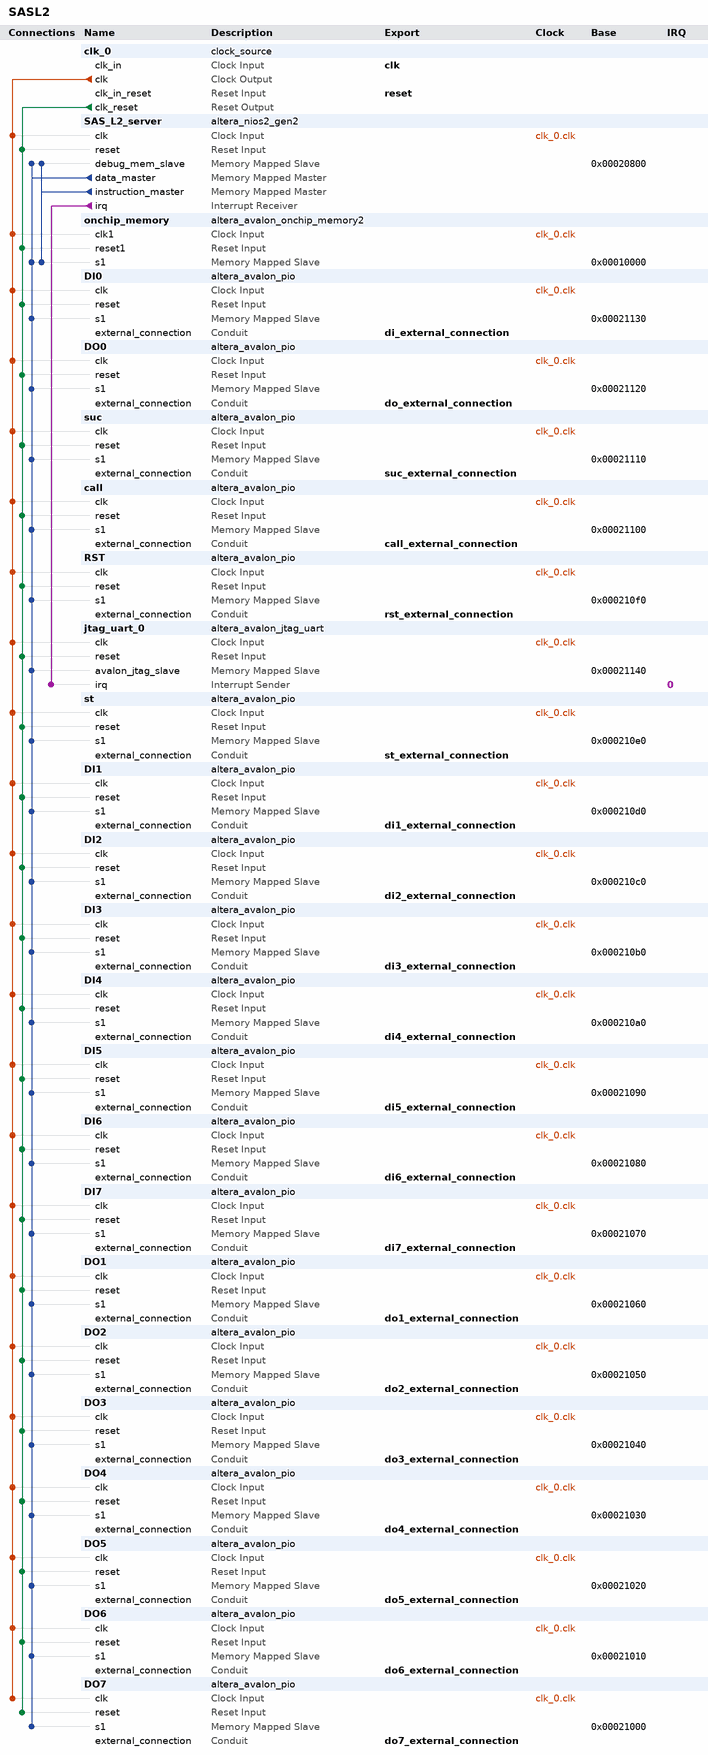
[diagram p0: system contents]
# Platform Designer (Qsys) system SASL2, MAX 10 10M50DAF484C7G
# Parameters at their usual value, and those the tool derives, are not listed.
package require -exact qsys 18.1
create_system SASL2
set_project_property DEVICE_FAMILY {MAX 10}
set_project_property DEVICE 10M50DAF484C7G

add_instance clk_0 clock_source 18.1
set_instance_parameter_value clk_0 clockFrequency 50000000

add_instance SAS_L2_server altera_nios2_gen2 18.1
set_instance_parameter_value SAS_L2_server dcache_size 2048
set_instance_parameter_value SAS_L2_server exceptionSlave onchip_memory.s1
set_instance_parameter_value SAS_L2_server icache_size 4096
set_instance_parameter_value SAS_L2_server impl Tiny
set_instance_parameter_value SAS_L2_server resetSlave onchip_memory.s1

add_instance onchip_memory altera_avalon_onchip_memory2 18.1
set_instance_parameter_value onchip_memory dataWidth 32
set_instance_parameter_value onchip_memory dualPort false
set_instance_parameter_value onchip_memory initMemContent false
set_instance_parameter_value onchip_memory initializationFileName onchip_mem.hex
set_instance_parameter_value onchip_memory memorySize 65536

add_instance DI0 altera_avalon_pio 18.1
set_instance_parameter_value DI0 direction Output
set_instance_parameter_value DI0 width 32

add_instance DO0 altera_avalon_pio 18.1
set_instance_parameter_value DO0 captureEdge true
set_instance_parameter_value DO0 direction Input
set_instance_parameter_value DO0 simDoTestBenchWiring true
set_instance_parameter_value DO0 simDrivenValue 1
set_instance_parameter_value DO0 width 32

add_instance suc altera_avalon_pio 18.1
set_instance_parameter_value suc direction Output
set_instance_parameter_value suc width 1

add_instance call altera_avalon_pio 18.1
set_instance_parameter_value call direction Output
set_instance_parameter_value call width 1

add_instance RST altera_avalon_pio 18.1
set_instance_parameter_value RST direction Output
set_instance_parameter_value RST width 1

add_instance jtag_uart_0 altera_avalon_jtag_uart 18.1
set_instance_parameter_value jtag_uart_0 simInteractiveOptions NO_INTERACTIVE_WINDOWS

add_instance st altera_avalon_pio 18.1
set_instance_parameter_value st captureEdge true
set_instance_parameter_value st direction Input
set_instance_parameter_value st width 3

add_instance DI1 altera_avalon_pio 18.1
set_instance_parameter_value DI1 direction Output
set_instance_parameter_value DI1 width 32

add_instance DI2 altera_avalon_pio 18.1
set_instance_parameter_value DI2 direction Output
set_instance_parameter_value DI2 width 32

add_instance DI3 altera_avalon_pio 18.1
set_instance_parameter_value DI3 direction Output
set_instance_parameter_value DI3 width 32

add_instance DI4 altera_avalon_pio 18.1
set_instance_parameter_value DI4 direction Output
set_instance_parameter_value DI4 width 32

add_instance DI5 altera_avalon_pio 18.1
set_instance_parameter_value DI5 direction Output
set_instance_parameter_value DI5 width 32

add_instance DI6 altera_avalon_pio 18.1
set_instance_parameter_value DI6 direction Output
set_instance_parameter_value DI6 width 32

add_instance DI7 altera_avalon_pio 18.1
set_instance_parameter_value DI7 direction Output
set_instance_parameter_value DI7 width 32

add_instance DO1 altera_avalon_pio 18.1
set_instance_parameter_value DO1 captureEdge true
set_instance_parameter_value DO1 direction Input
set_instance_parameter_value DO1 simDoTestBenchWiring true
set_instance_parameter_value DO1 simDrivenValue 1
set_instance_parameter_value DO1 width 32

add_instance DO2 altera_avalon_pio 18.1
set_instance_parameter_value DO2 captureEdge true
set_instance_parameter_value DO2 direction Input
set_instance_parameter_value DO2 simDoTestBenchWiring true
set_instance_parameter_value DO2 simDrivenValue 1
set_instance_parameter_value DO2 width 32

add_instance DO3 altera_avalon_pio 18.1
set_instance_parameter_value DO3 captureEdge true
set_instance_parameter_value DO3 direction Input
set_instance_parameter_value DO3 simDoTestBenchWiring true
set_instance_parameter_value DO3 simDrivenValue 1
set_instance_parameter_value DO3 width 32

add_instance DO4 altera_avalon_pio 18.1
set_instance_parameter_value DO4 captureEdge true
set_instance_parameter_value DO4 direction Input
set_instance_parameter_value DO4 simDoTestBenchWiring true
set_instance_parameter_value DO4 simDrivenValue 1
set_instance_parameter_value DO4 width 32

add_instance DO5 altera_avalon_pio 18.1
set_instance_parameter_value DO5 captureEdge true
set_instance_parameter_value DO5 direction Input
set_instance_parameter_value DO5 simDoTestBenchWiring true
set_instance_parameter_value DO5 simDrivenValue 1
set_instance_parameter_value DO5 width 32

add_instance DO6 altera_avalon_pio 18.1
set_instance_parameter_value DO6 captureEdge true
set_instance_parameter_value DO6 direction Input
set_instance_parameter_value DO6 simDoTestBenchWiring true
set_instance_parameter_value DO6 simDrivenValue 1
set_instance_parameter_value DO6 width 32

add_instance DO7 altera_avalon_pio 18.1
set_instance_parameter_value DO7 captureEdge true
set_instance_parameter_value DO7 direction Input
set_instance_parameter_value DO7 simDoTestBenchWiring true
set_instance_parameter_value DO7 simDrivenValue 1
set_instance_parameter_value DO7 width 32

# connections
add_connection clk_0.clk call.clk clock
add_connection clk_0.clk DI0.clk clock
add_connection clk_0.clk DI1.clk clock
add_connection clk_0.clk DI2.clk clock
add_connection clk_0.clk DI3.clk clock
add_connection clk_0.clk DI4.clk clock
add_connection clk_0.clk DI5.clk clock
add_connection clk_0.clk DI6.clk clock
add_connection clk_0.clk DI7.clk clock
add_connection clk_0.clk DO0.clk clock
add_connection clk_0.clk DO1.clk clock
add_connection clk_0.clk DO2.clk clock
add_connection clk_0.clk DO3.clk clock
add_connection clk_0.clk DO4.clk clock
add_connection clk_0.clk DO5.clk clock
add_connection clk_0.clk DO6.clk clock
add_connection clk_0.clk DO7.clk clock
add_connection clk_0.clk jtag_uart_0.clk clock
add_connection clk_0.clk onchip_memory.clk1 clock
add_connection clk_0.clk RST.clk clock
add_connection clk_0.clk SAS_L2_server.clk clock
add_connection clk_0.clk st.clk clock
add_connection clk_0.clk suc.clk clock
add_connection clk_0.clk_reset call.reset reset
add_connection clk_0.clk_reset DI0.reset reset
add_connection clk_0.clk_reset DI1.reset reset
add_connection clk_0.clk_reset DI2.reset reset
add_connection clk_0.clk_reset DI3.reset reset
add_connection clk_0.clk_reset DI4.reset reset
add_connection clk_0.clk_reset DI5.reset reset
add_connection clk_0.clk_reset DI6.reset reset
add_connection clk_0.clk_reset DI7.reset reset
add_connection clk_0.clk_reset DO0.reset reset
add_connection clk_0.clk_reset DO1.reset reset
add_connection clk_0.clk_reset DO2.reset reset
add_connection clk_0.clk_reset DO3.reset reset
add_connection clk_0.clk_reset DO4.reset reset
add_connection clk_0.clk_reset DO5.reset reset
add_connection clk_0.clk_reset DO6.reset reset
add_connection clk_0.clk_reset DO7.reset reset
add_connection clk_0.clk_reset jtag_uart_0.reset reset
add_connection clk_0.clk_reset onchip_memory.reset1 reset
add_connection clk_0.clk_reset RST.reset reset
add_connection clk_0.clk_reset SAS_L2_server.reset reset
add_connection clk_0.clk_reset st.reset reset
add_connection clk_0.clk_reset suc.reset reset
add_connection SAS_L2_server.data_master call.s1 avalon
set_connection_parameter_value SAS_L2_server.data_master/call.s1 baseAddress 0x00021100
add_connection SAS_L2_server.data_master DI0.s1 avalon
set_connection_parameter_value SAS_L2_server.data_master/DI0.s1 baseAddress 0x00021130
add_connection SAS_L2_server.data_master DI1.s1 avalon
set_connection_parameter_value SAS_L2_server.data_master/DI1.s1 baseAddress 0x000210d0
add_connection SAS_L2_server.data_master DI2.s1 avalon
set_connection_parameter_value SAS_L2_server.data_master/DI2.s1 baseAddress 0x000210c0
add_connection SAS_L2_server.data_master DI3.s1 avalon
set_connection_parameter_value SAS_L2_server.data_master/DI3.s1 baseAddress 0x000210b0
add_connection SAS_L2_server.data_master DI4.s1 avalon
set_connection_parameter_value SAS_L2_server.data_master/DI4.s1 baseAddress 0x000210a0
add_connection SAS_L2_server.data_master DI5.s1 avalon
set_connection_parameter_value SAS_L2_server.data_master/DI5.s1 baseAddress 0x00021090
add_connection SAS_L2_server.data_master DI6.s1 avalon
set_connection_parameter_value SAS_L2_server.data_master/DI6.s1 baseAddress 0x00021080
add_connection SAS_L2_server.data_master DI7.s1 avalon
set_connection_parameter_value SAS_L2_server.data_master/DI7.s1 baseAddress 0x00021070
add_connection SAS_L2_server.data_master DO0.s1 avalon
set_connection_parameter_value SAS_L2_server.data_master/DO0.s1 baseAddress 0x00021120
add_connection SAS_L2_server.data_master DO1.s1 avalon
set_connection_parameter_value SAS_L2_server.data_master/DO1.s1 baseAddress 0x00021060
add_connection SAS_L2_server.data_master DO2.s1 avalon
set_connection_parameter_value SAS_L2_server.data_master/DO2.s1 baseAddress 0x00021050
add_connection SAS_L2_server.data_master DO3.s1 avalon
set_connection_parameter_value SAS_L2_server.data_master/DO3.s1 baseAddress 0x00021040
add_connection SAS_L2_server.data_master DO4.s1 avalon
set_connection_parameter_value SAS_L2_server.data_master/DO4.s1 baseAddress 0x00021030
add_connection SAS_L2_server.data_master DO5.s1 avalon
set_connection_parameter_value SAS_L2_server.data_master/DO5.s1 baseAddress 0x00021020
add_connection SAS_L2_server.data_master DO6.s1 avalon
set_connection_parameter_value SAS_L2_server.data_master/DO6.s1 baseAddress 0x00021010
add_connection SAS_L2_server.data_master DO7.s1 avalon
set_connection_parameter_value SAS_L2_server.data_master/DO7.s1 baseAddress 0x00021000
add_connection SAS_L2_server.data_master jtag_uart_0.avalon_jtag_slave avalon
set_connection_parameter_value SAS_L2_server.data_master/jtag_uart_0.avalon_jtag_slave baseAddress 0x00021140
add_connection SAS_L2_server.data_master onchip_memory.s1 avalon
set_connection_parameter_value SAS_L2_server.data_master/onchip_memory.s1 baseAddress 0x00010000
add_connection SAS_L2_server.data_master RST.s1 avalon
set_connection_parameter_value SAS_L2_server.data_master/RST.s1 baseAddress 0x000210f0
add_connection SAS_L2_server.data_master SAS_L2_server.debug_mem_slave avalon
set_connection_parameter_value SAS_L2_server.data_master/SAS_L2_server.debug_mem_slave baseAddress 0x00020800
add_connection SAS_L2_server.data_master st.s1 avalon
set_connection_parameter_value SAS_L2_server.data_master/st.s1 baseAddress 0x000210e0
add_connection SAS_L2_server.data_master suc.s1 avalon
set_connection_parameter_value SAS_L2_server.data_master/suc.s1 baseAddress 0x00021110
add_connection SAS_L2_server.instruction_master onchip_memory.s1 avalon
set_connection_parameter_value SAS_L2_server.instruction_master/onchip_memory.s1 baseAddress 0x00010000
add_connection SAS_L2_server.instruction_master SAS_L2_server.debug_mem_slave avalon
set_connection_parameter_value SAS_L2_server.instruction_master/SAS_L2_server.debug_mem_slave baseAddress 0x00020800
add_connection SAS_L2_server.irq jtag_uart_0.irq interrupt
set_connection_parameter_value SAS_L2_server.irq/jtag_uart_0.irq irqNumber 0

# exported interfaces
add_interface call_external_connection conduit end
set_interface_property call_external_connection EXPORT_OF call.external_connection
add_interface clk clock sink
set_interface_property clk EXPORT_OF clk_0.clk_in
add_interface di1_external_connection conduit end
set_interface_property di1_external_connection EXPORT_OF DI1.external_connection
add_interface di2_external_connection conduit end
set_interface_property di2_external_connection EXPORT_OF DI2.external_connection
add_interface di3_external_connection conduit end
set_interface_property di3_external_connection EXPORT_OF DI3.external_connection
add_interface di4_external_connection conduit end
set_interface_property di4_external_connection EXPORT_OF DI4.external_connection
add_interface di5_external_connection conduit end
set_interface_property di5_external_connection EXPORT_OF DI5.external_connection
add_interface di6_external_connection conduit end
set_interface_property di6_external_connection EXPORT_OF DI6.external_connection
add_interface di7_external_connection conduit end
set_interface_property di7_external_connection EXPORT_OF DI7.external_connection
add_interface di_external_connection conduit end
set_interface_property di_external_connection EXPORT_OF DI0.external_connection
add_interface do1_external_connection conduit end
set_interface_property do1_external_connection EXPORT_OF DO1.external_connection
add_interface do2_external_connection conduit end
set_interface_property do2_external_connection EXPORT_OF DO2.external_connection
add_interface do3_external_connection conduit end
set_interface_property do3_external_connection EXPORT_OF DO3.external_connection
add_interface do4_external_connection conduit end
set_interface_property do4_external_connection EXPORT_OF DO4.external_connection
add_interface do5_external_connection conduit end
set_interface_property do5_external_connection EXPORT_OF DO5.external_connection
add_interface do6_external_connection conduit end
set_interface_property do6_external_connection EXPORT_OF DO6.external_connection
add_interface do7_external_connection conduit end
set_interface_property do7_external_connection EXPORT_OF DO7.external_connection
add_interface do_external_connection conduit end
set_interface_property do_external_connection EXPORT_OF DO0.external_connection
add_interface reset reset sink
set_interface_property reset EXPORT_OF clk_0.clk_in_reset
add_interface rst_external_connection conduit end
set_interface_property rst_external_connection EXPORT_OF RST.external_connection
add_interface st_external_connection conduit end
set_interface_property st_external_connection EXPORT_OF st.external_connection
add_interface suc_external_connection conduit end
set_interface_property suc_external_connection EXPORT_OF suc.external_connection

set_interconnect_requirement {$system} qsys_mm.clockCrossingAdapter HANDSHAKE
set_interconnect_requirement {$system} qsys_mm.enableEccProtection FALSE
set_interconnect_requirement {$system} qsys_mm.insertDefaultSlave FALSE
set_interconnect_requirement {$system} qsys_mm.maxAdditionalLatency 1

save_system SASL2.qsys
